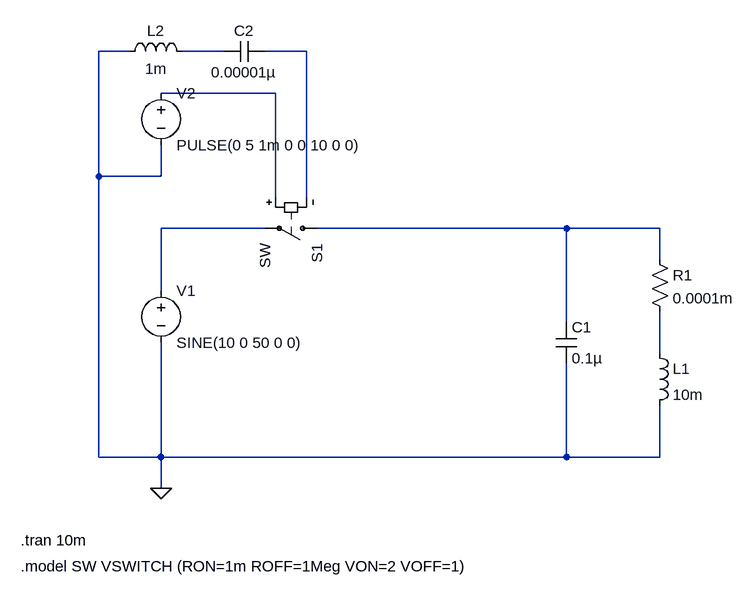
[diagram p0: schematic noise-gen-v2.asc]
noise-gen-v2.asc, the LTspice schematic file:
Version 4.1
SHEET 1 880 680
WIRE -112 -192 -160 -192
WIRE 32 -192 -32 -192
WIRE 160 -192 96 -192
WIRE 112 -128 -64 -128
WIRE -160 0 -160 -192
WIRE -64 0 -64 -48
WIRE -64 0 -160 0
WIRE 112 32 112 -128
WIRE 160 32 160 -192
WIRE 96 80 -64 80
WIRE 560 80 176 80
WIRE 704 80 560 80
WIRE 704 128 704 80
WIRE -64 176 -64 80
WIRE 560 224 560 80
WIRE 704 272 704 208
WIRE -160 432 -160 0
WIRE -64 432 -64 256
WIRE -64 432 -160 432
WIRE 560 432 560 288
WIRE 560 432 -64 432
WIRE 704 432 704 352
WIRE 704 432 560 432
WIRE -64 480 -64 432
FLAG -64 480 0
SYMBOL voltage -64 160 R0
WINDOW 123 0 0 Left 0
WINDOW 39 0 0 Left 0
SYMATTR InstName V1
SYMATTR Value SINE(10 0 50 0 0)
SYMBOL sw 192 80 R90
SYMATTR InstName S1
SYMBOL voltage -64 -144 R0
WINDOW 123 0 0 Left 0
WINDOW 39 0 0 Left 0
SYMATTR InstName V2
SYMATTR Value PULSE(0 5 1m 0 0 10 0 0)
SYMBOL res 688 112 R0
SYMATTR InstName R1
SYMATTR Value 0.0001m
SYMBOL ind 688 256 R0
SYMATTR InstName L1
SYMATTR Value 10m
SYMBOL cap 544 224 R0
SYMATTR InstName C1
SYMATTR Value 0.1µ
SYMBOL ind -128 -176 R270
WINDOW 0 32 56 VTop 2
WINDOW 3 5 56 VBottom 2
SYMATTR InstName L2
SYMATTR Value 1m
SYMBOL cap 32 -176 R270
WINDOW 0 32 32 VTop 2
WINDOW 3 0 32 VBottom 2
SYMATTR InstName C2
SYMATTR Value 0.00001µ
TEXT -280 560 Left 2 !.tran 10m
TEXT -280 600 Left 2 !.model SW VSWITCH (RON=1m ROFF=1Meg VON=2 VOFF=1)

The netlist it stands for:
* noise-gen-v2.asc
V1 N004 0 SINE(10 0 50 0 0)
S1 N005 N004 N003 N002 SW
V2 N003 0 PULSE(0 5 1m 0 0 10 0 0)
R1 N005 N006 0.0001m
L1 N006 0 10m
C1 N005 0 0.1µ
L2 0 N001 1m
C2 N001 N002 0.00001µ
.tran 10m
.model SW VSWITCH (RON=1m ROFF=1Meg VON=2 VOFF=1)
.backanno
.end